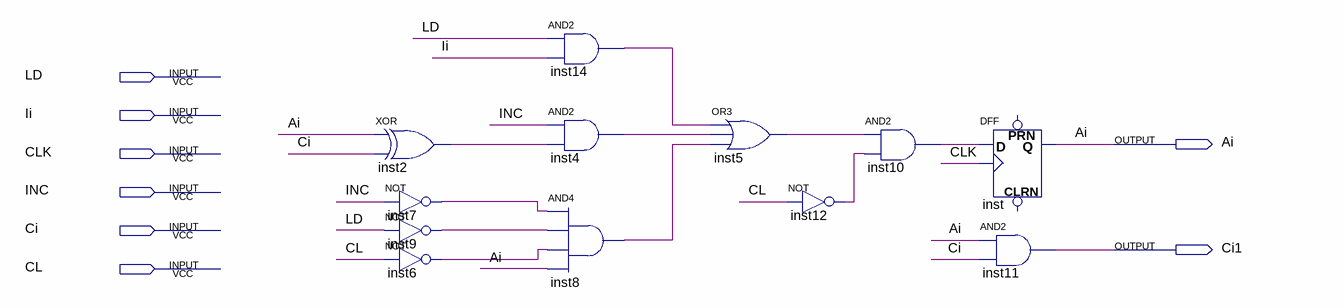
[diagram p0: schematic sheet]
// Quartus schematic REG1_LD_CL_INC.bdf as structural Verilog: 12 symbols, 8 pins
module REG1_LD_CL_INC (
  input  LD,
  input  Ii,
  input  CLK,
  input  INC,
  input  Ci,
  input  CL,
  output Ai,
  output Ci1
);

  wire inst2_out, inst4_out, inst5_out, inst6_out, inst7_out, inst8_out, inst9_out, inst10_out, inst12_out,
       inst14_out;

  xor inst2 (inst2_out, Ai, Ci);
  not inst7 (inst7_out, INC);
  not inst9 (inst9_out, LD);
  not inst6 (inst6_out, CL);
  and inst14 (inst14_out, LD, Ii);
  and inst4 (inst4_out, INC, inst2_out);
  and inst8 (inst8_out, inst7_out, inst9_out, inst6_out, Ai);
  or inst5 (inst5_out, inst14_out, inst4_out, inst8_out);
  not inst12 (inst12_out, CL);
  and inst10 (inst10_out, inst5_out, inst12_out);
  DFF inst (.CLK(CLK), .D(inst10_out), .Q(Ai));  // open: CLRN, PRN
  and inst11 (Ci1, Ai, Ci);
endmodule
